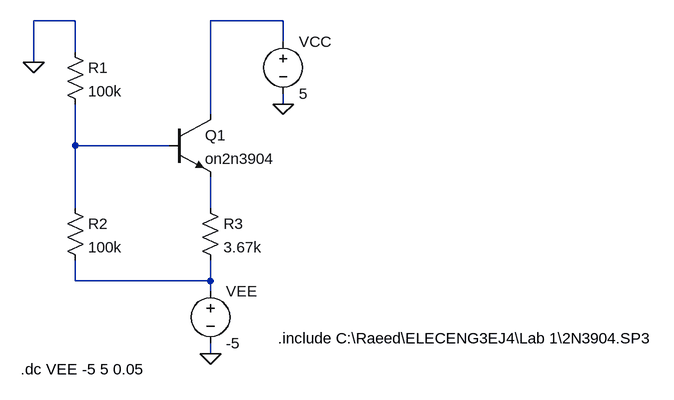
[diagram p0: schematic Part3.asc]
Part3.asc, the LTspice schematic file:
Version 4
SHEET 1 1024 680
WIRE 96 0 32 0
WIRE 416 0 304 0
WIRE 416 32 416 0
WIRE 96 48 96 0
WIRE 32 64 32 0
WIRE 416 128 416 112
WIRE 304 144 304 0
WIRE 96 192 96 128
WIRE 240 192 96 192
WIRE 96 288 96 192
WIRE 304 288 304 240
WIRE 96 400 96 368
WIRE 304 400 304 368
WIRE 304 400 96 400
WIRE 304 416 304 400
WIRE 304 512 304 496
FLAG 32 64 0
FLAG 416 128 0
FLAG 304 512 0
SYMBOL res 80 32 R0
SYMATTR InstName R1
SYMATTR Value 100k
SYMBOL res 80 272 R0
SYMATTR InstName R2
SYMATTR Value 100k
SYMBOL res 288 272 R0
SYMATTR InstName R3
SYMATTR Value 3.67k
SYMBOL npn 240 144 R0
SYMATTR InstName Q1
SYMATTR Value on2n3904
SYMBOL voltage 416 16 R0
WINDOW 123 0 0 Left 0
WINDOW 39 0 0 Left 0
SYMATTR InstName VCC
SYMATTR Value 5
SYMBOL voltage 304 400 R0
WINDOW 123 0 0 Left 0
WINDOW 39 0 0 Left 0
SYMATTR InstName VEE
SYMATTR Value -5
TEXT 408 488 Left 2 !.include C:\\Raeed\\ELECENG3EJ4\\Lab 1\\2N3904.SP3
TEXT 12 536 Left 2 !.dc VEE -5 5 0.05

The netlist it stands for:
* Part3.asc
R1 0 N002 100k
R2 N002 N004 100k
R3 N003 N004 3.67k
Q1 N001 N002 N003 0 on2n3904
VCC N001 0 5
VEE N004 0 -5
.model NPN NPN
.model PNP PNP
.lib standard.bjt
.include C:\Raeed\ELECENG3EJ4\Lab 1\2N3904.SP3
.dc VEE -5 5 0.05
.backanno
.end